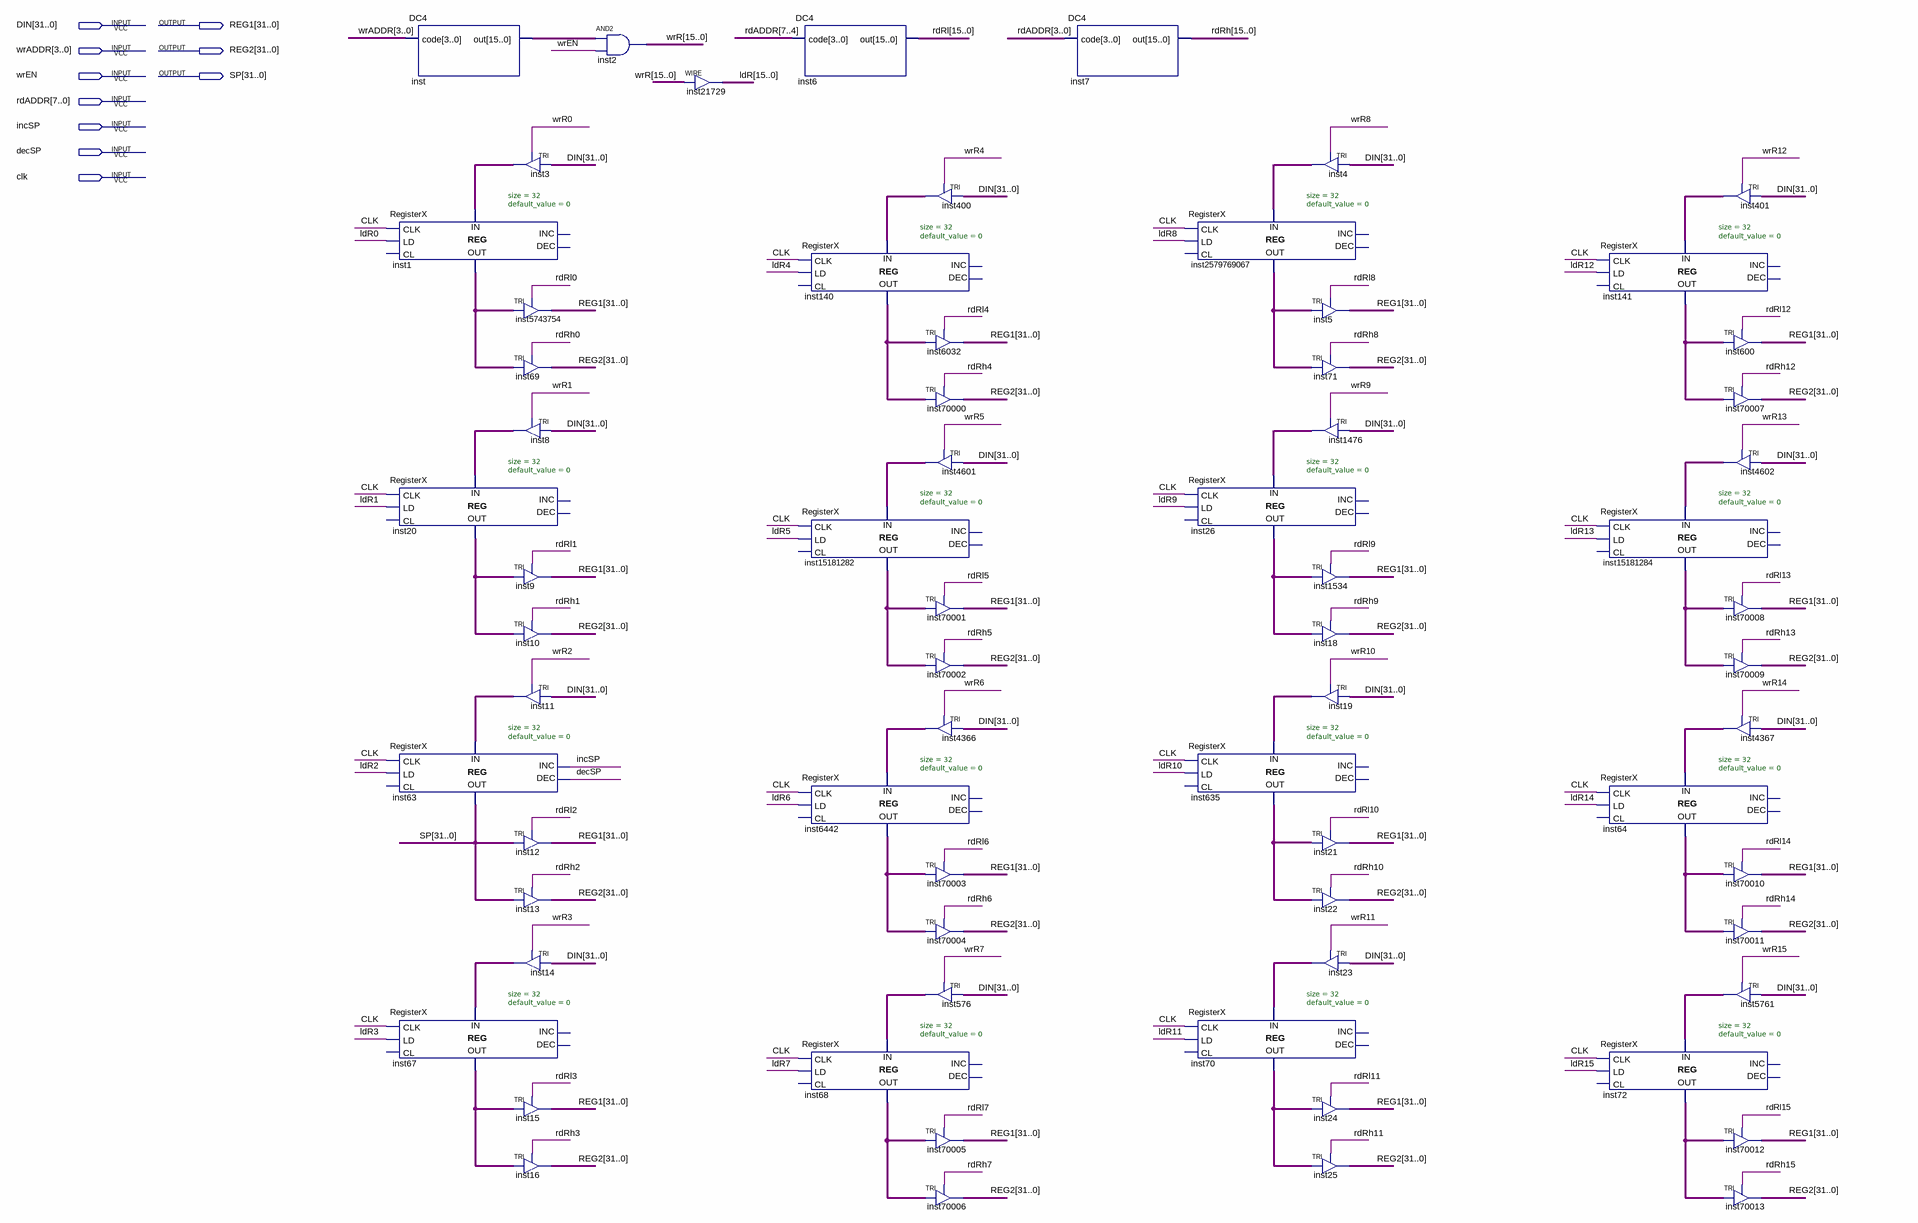
[diagram p0: schematic sheet]
// Quartus schematic GPR.bdf as structural Verilog: 69 symbols, 10 pins
module GPR (
  input  [31:0] DIN,
  input  [3:0] wrADDR,
  input  wrEN,
  input  [7:0] rdADDR,
  input  incSP,
  input  decSP,
  input  clk,
  output [31:0] REG1,
  output [31:0] REG2,
  output [31:0] SP
);

  wire [15:0] inst_out, ldR, rdRh, rdRl, wrR;
  wire [31:0] inst1_data_out, inst3_out, inst4_out, inst8_out, inst11_out, inst14_out, inst19_out,
       inst20_data_out, inst23_out, inst26_data_out, inst64_data_out, inst67_data_out, inst68_data_out,
       inst70_data_out, inst72_data_out, inst140_data_out, inst141_data_out, inst400_out, inst401_out,
       inst576_out, inst635_data_out, inst1476_out, inst4366_out, inst4367_out, inst4601_out, inst4602_out,
       inst5761_out, inst6442_data_out, inst15181282_data_out, inst15181284_data_out, inst2579769067_data_out;

  DC4 inst (.code(wrADDR), .out(inst_out));
  RegisterX #(.size(32), .default_value(0)) inst1 (
    .CLK(clk), .LD(ldR[0]), .DATA_IN(inst3_out), .DATA_OUT(inst1_data_out));  // open: CL, INC, DEC
  RegisterX #(.size(32), .default_value(0)) inst20 (
    .CLK(clk), .LD(ldR[1]), .DATA_IN(inst8_out), .DATA_OUT(inst20_data_out));  // open: CL, INC, DEC
  RegisterX #(.size(32), .default_value(0)) inst63 (
    .CLK(clk), .LD(ldR[2]), .INC(incSP), .DEC(decSP), .DATA_IN(inst11_out), .DATA_OUT(SP));  // open: CL
  RegisterX #(.size(32), .default_value(0)) inst67 (
    .CLK(clk), .LD(ldR[3]), .DATA_IN(inst14_out), .DATA_OUT(inst67_data_out));  // open: CL, INC, DEC
  TRI inst3[31:0] (.IN(DIN), .OE(wrR[0]), .OUT(inst3_out));
  TRI inst5743754[31:0] (.IN(inst1_data_out), .OE(rdRl[0]), .OUT(REG1));
  TRI inst69[31:0] (.IN(inst1_data_out), .OE(rdRh[0]), .OUT(REG2));
  TRI inst8[31:0] (.IN(DIN), .OE(wrR[1]), .OUT(inst8_out));
  TRI inst9[31:0] (.IN(inst20_data_out), .OE(rdRl[1]), .OUT(REG1));
  TRI inst10[31:0] (.IN(inst20_data_out), .OE(rdRh[1]), .OUT(REG2));
  TRI inst11[31:0] (.IN(DIN), .OE(wrR[2]), .OUT(inst11_out));
  TRI inst12[31:0] (.IN(SP), .OE(rdRl[2]), .OUT(REG1));
  TRI inst13[31:0] (.IN(SP), .OE(rdRh[2]), .OUT(REG2));
  TRI inst14[31:0] (.IN(DIN), .OE(wrR[3]), .OUT(inst14_out));
  TRI inst15[31:0] (.IN(inst67_data_out), .OE(rdRl[3]), .OUT(REG1));
  TRI inst16[31:0] (.IN(inst67_data_out), .OE(rdRh[3]), .OUT(REG2));
  assign wrR = inst_out & {16{wrEN}};  // AND2 inst2, 16 bits wide
  assign ldR = wrR;  // WIRE inst21729
  DC4 inst6 (.code(rdADDR[7:4]), .out(rdRl));
  RegisterX #(.size(32), .default_value(0)) inst140 (
    .CLK(clk), .LD(ldR[4]), .DATA_IN(inst400_out), .DATA_OUT(inst140_data_out));  // open: CL, INC, DEC
  RegisterX #(.size(32), .default_value(0)) inst15181282 (
    .CLK(clk), .LD(ldR[5]), .DATA_IN(inst4601_out), .DATA_OUT(inst15181282_data_out));  // open: CL, INC, DEC
  RegisterX #(.size(32), .default_value(0)) inst6442 (
    .CLK(clk), .LD(ldR[6]), .DATA_IN(inst4366_out), .DATA_OUT(inst6442_data_out));  // open: CL, INC, DEC
  RegisterX #(.size(32), .default_value(0)) inst68 (
    .CLK(clk), .LD(ldR[7]), .DATA_IN(inst576_out), .DATA_OUT(inst68_data_out));  // open: CL, INC, DEC
  TRI inst400[31:0] (.IN(DIN), .OE(wrR[4]), .OUT(inst400_out));
  TRI inst6032[31:0] (.IN(inst140_data_out), .OE(rdRl[4]), .OUT(REG1));
  TRI inst70000[31:0] (.IN(inst140_data_out), .OE(rdRh[4]), .OUT(REG2));
  TRI inst4601[31:0] (.IN(DIN), .OE(wrR[5]), .OUT(inst4601_out));
  TRI inst70001[31:0] (.IN(inst15181282_data_out), .OE(rdRl[5]), .OUT(REG1));
  TRI inst70002[31:0] (.IN(inst15181282_data_out), .OE(rdRh[5]), .OUT(REG2));
  TRI inst4366[31:0] (.IN(DIN), .OE(wrR[6]), .OUT(inst4366_out));
  TRI inst70003[31:0] (.IN(inst6442_data_out), .OE(rdRl[6]), .OUT(REG1));
  TRI inst70004[31:0] (.IN(inst6442_data_out), .OE(rdRh[6]), .OUT(REG2));
  TRI inst576[31:0] (.IN(DIN), .OE(wrR[7]), .OUT(inst576_out));
  TRI inst70005[31:0] (.IN(inst68_data_out), .OE(rdRl[7]), .OUT(REG1));
  TRI inst70006[31:0] (.IN(inst68_data_out), .OE(rdRh[7]), .OUT(REG2));
  DC4 inst7 (.code(rdADDR[3:0]), .out(rdRh));
  RegisterX #(.size(32), .default_value(0)) inst2579769067 (
    .CLK(clk), .LD(ldR[8]), .DATA_IN(inst4_out), .DATA_OUT(inst2579769067_data_out));  // open: CL, INC, DEC
  RegisterX #(.size(32), .default_value(0)) inst26 (
    .CLK(clk), .LD(ldR[9]), .DATA_IN(inst1476_out), .DATA_OUT(inst26_data_out));  // open: CL, INC, DEC
  RegisterX #(.size(32), .default_value(0)) inst635 (
    .CLK(clk), .LD(ldR[10]), .DATA_IN(inst19_out), .DATA_OUT(inst635_data_out));  // open: CL, INC, DEC
  RegisterX #(.size(32), .default_value(0)) inst70 (
    .CLK(clk), .LD(ldR[11]), .DATA_IN(inst23_out), .DATA_OUT(inst70_data_out));  // open: CL, INC, DEC
  TRI inst4[31:0] (.IN(DIN), .OE(wrR[8]), .OUT(inst4_out));
  TRI inst5[31:0] (.IN(inst2579769067_data_out), .OE(rdRl[8]), .OUT(REG1));
  TRI inst71[31:0] (.IN(inst2579769067_data_out), .OE(rdRh[8]), .OUT(REG2));
  TRI inst1476[31:0] (.IN(DIN), .OE(wrR[9]), .OUT(inst1476_out));
  TRI inst1534[31:0] (.IN(inst26_data_out), .OE(rdRl[9]), .OUT(REG1));
  TRI inst18[31:0] (.IN(inst26_data_out), .OE(rdRh[9]), .OUT(REG2));
  TRI inst19[31:0] (.IN(DIN), .OE(wrR[10]), .OUT(inst19_out));
  TRI inst21[31:0] (.IN(inst635_data_out), .OE(rdRl[10]), .OUT(REG1));
  TRI inst22[31:0] (.IN(inst635_data_out), .OE(rdRh[10]), .OUT(REG2));
  TRI inst23[31:0] (.IN(DIN), .OE(wrR[11]), .OUT(inst23_out));
  TRI inst24[31:0] (.IN(inst70_data_out), .OE(rdRl[11]), .OUT(REG1));
  TRI inst25[31:0] (.IN(inst70_data_out), .OE(rdRh[11]), .OUT(REG2));
  RegisterX #(.size(32), .default_value(0)) inst141 (
    .CLK(clk), .LD(ldR[12]), .DATA_IN(inst401_out), .DATA_OUT(inst141_data_out));  // open: CL, INC, DEC
  RegisterX #(.size(32), .default_value(0)) inst15181284 (
    .CLK(clk), .LD(ldR[13]), .DATA_IN(inst4602_out), .DATA_OUT(inst15181284_data_out));  // open: CL, INC, DEC
  RegisterX #(.size(32), .default_value(0)) inst64 (
    .CLK(clk), .LD(ldR[14]), .DATA_IN(inst4367_out), .DATA_OUT(inst64_data_out));  // open: CL, INC, DEC
  RegisterX #(.size(32), .default_value(0)) inst72 (
    .CLK(clk), .LD(ldR[15]), .DATA_IN(inst5761_out), .DATA_OUT(inst72_data_out));  // open: CL, INC, DEC
  TRI inst401[31:0] (.IN(DIN), .OE(wrR[12]), .OUT(inst401_out));
  TRI inst600[31:0] (.IN(inst141_data_out), .OE(rdRl[12]), .OUT(REG1));
  TRI inst70007[31:0] (.IN(inst141_data_out), .OE(rdRh[12]), .OUT(REG2));
  TRI inst4602[31:0] (.IN(DIN), .OE(wrR[13]), .OUT(inst4602_out));
  TRI inst70008[31:0] (.IN(inst15181284_data_out), .OE(rdRl[13]), .OUT(REG1));
  TRI inst70009[31:0] (.IN(inst15181284_data_out), .OE(rdRh[13]), .OUT(REG2));
  TRI inst4367[31:0] (.IN(DIN), .OE(wrR[14]), .OUT(inst4367_out));
  TRI inst70010[31:0] (.IN(inst64_data_out), .OE(rdRl[14]), .OUT(REG1));
  TRI inst70011[31:0] (.IN(inst64_data_out), .OE(rdRh[14]), .OUT(REG2));
  TRI inst5761[31:0] (.IN(DIN), .OE(wrR[15]), .OUT(inst5761_out));
  TRI inst70012[31:0] (.IN(inst72_data_out), .OE(rdRl[15]), .OUT(REG1));
  TRI inst70013[31:0] (.IN(inst72_data_out), .OE(rdRh[15]), .OUT(REG2));
endmodule
